# Altium schematic sheet LCD1807301228.SchDoc
size A3
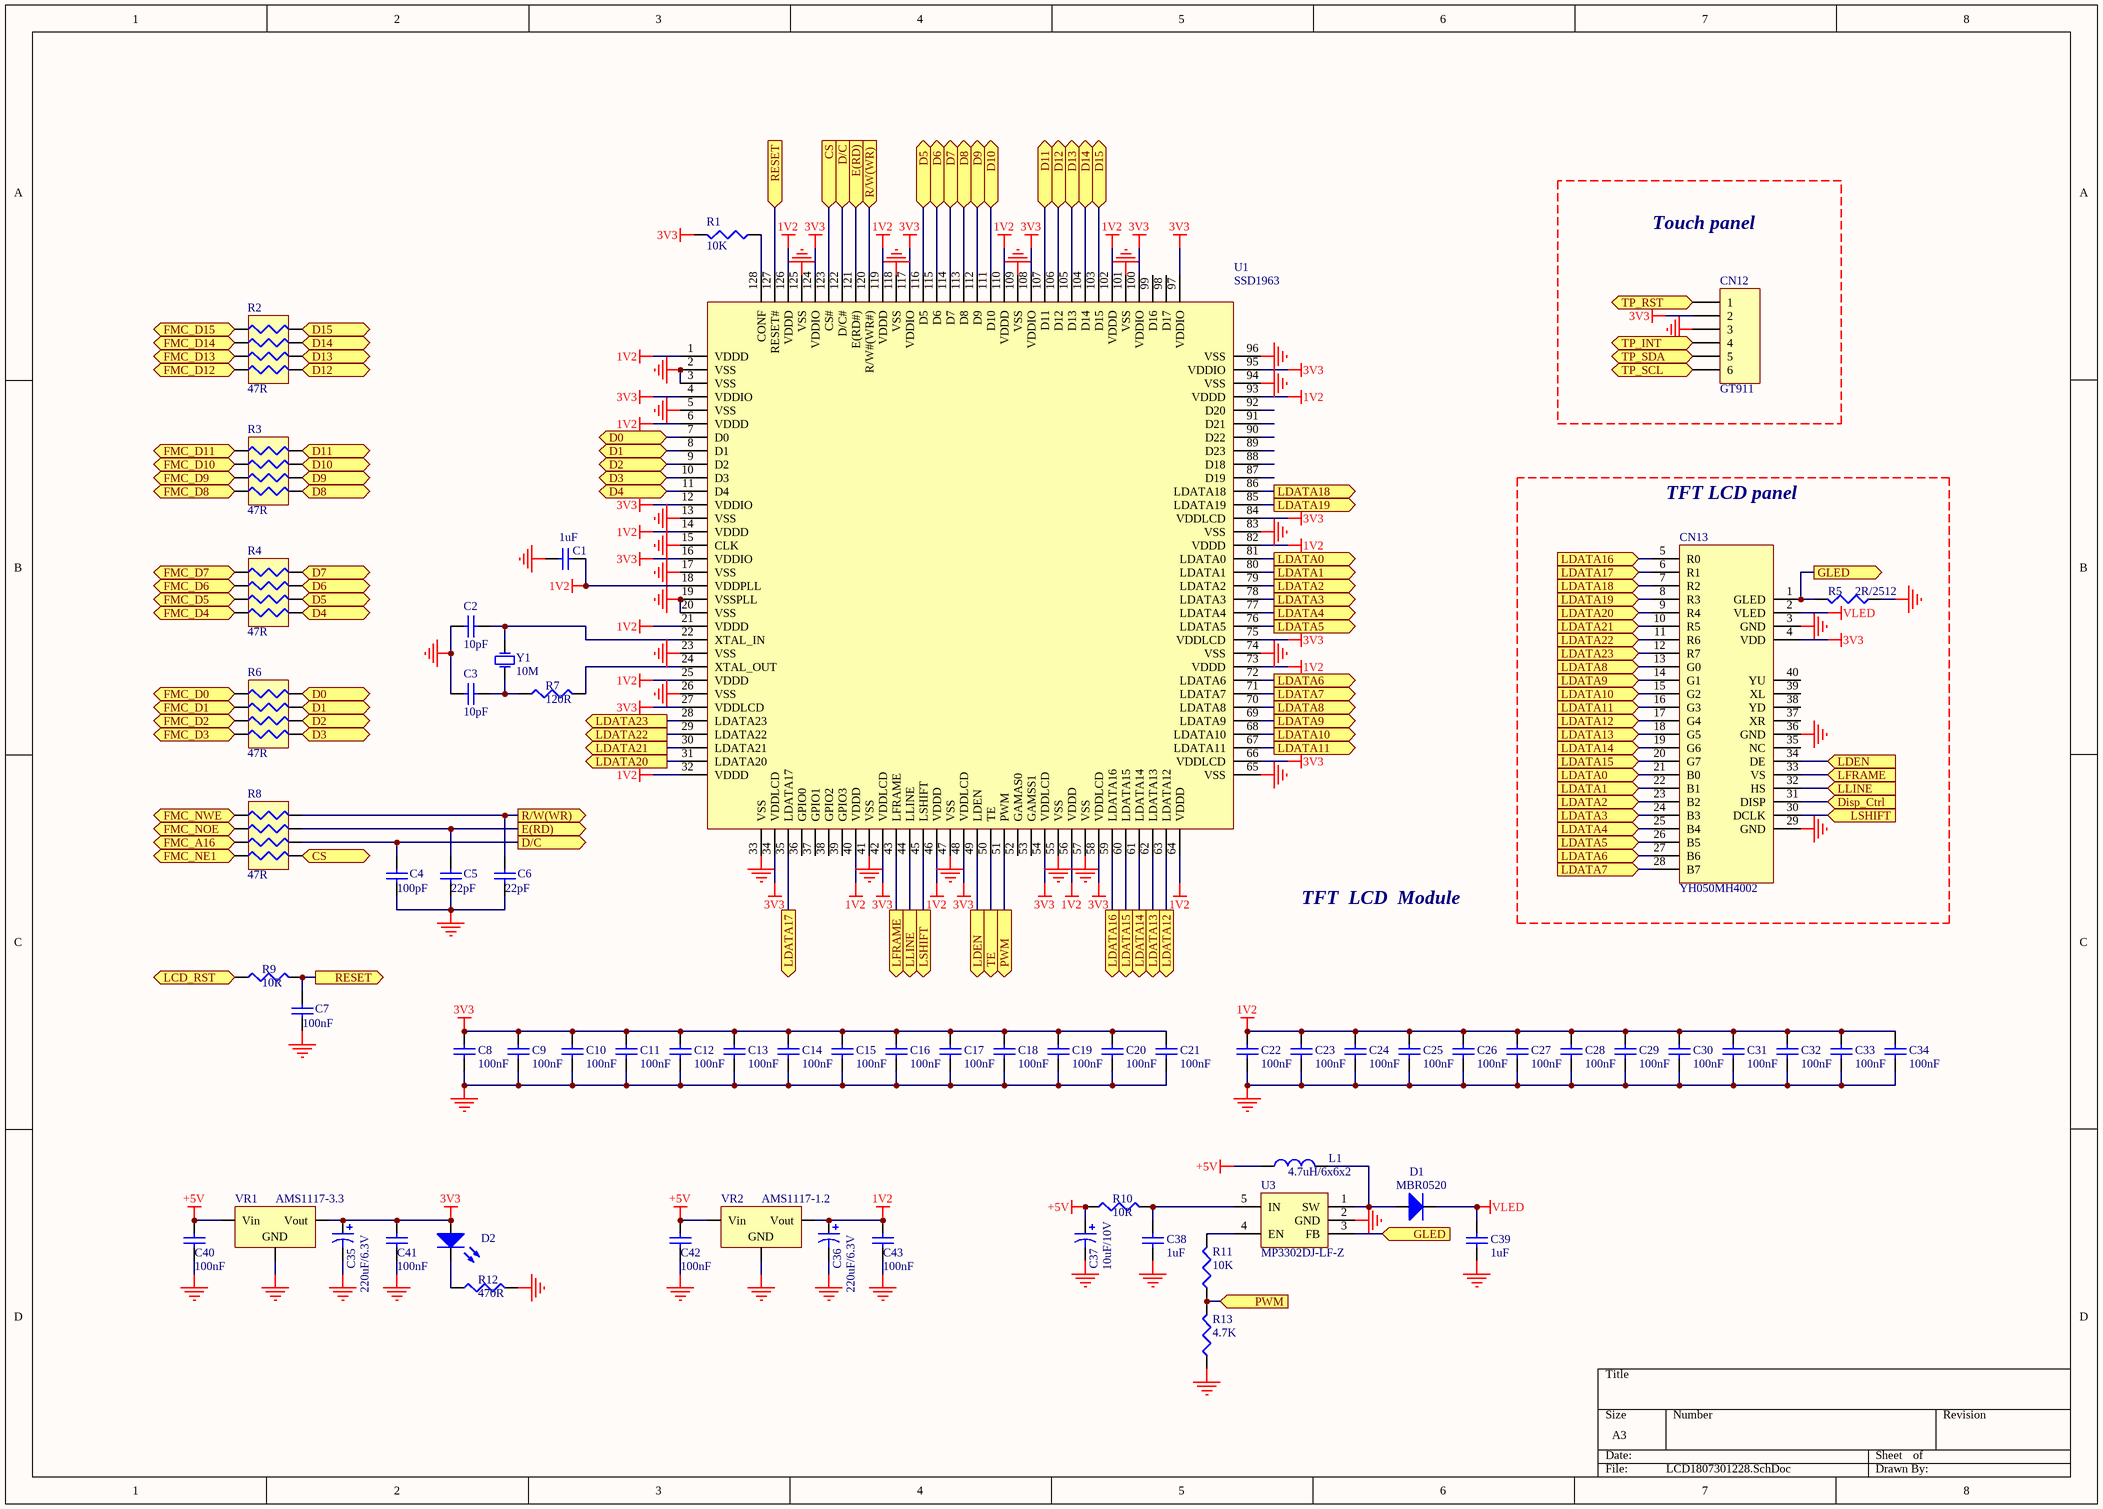
[diagram p0: LCD1807301228.SchDoc]

## Parts
C1  1uF  [C0603-3]
C2  10pF  [C0603-3]
C3  10pF  [C0603-3]
C4  100pF  [C0603-3]
C5  22pF  [C0603-3]
C6  22pF  [C0603-3]
C7  100nF  [C0603-3]
C8  100nF  [C0603-3]
C9  100nF  [C0603-3]
C10  100nF  [C0603-3]
C11  100nF  [C0603-3]
C12  100nF  [C0603-3]
C13  100nF  [C0603-3]
C14  100nF  [C0603-3]
C15  100nF  [C0603-3]
C16  100nF  [C0603-3]
C17  100nF  [C0603-3]
C18  100nF  [C0603-3]
C19  100nF  [C0603-3]
C20  100nF  [C0603-3]
C21  100nF  [C0603-3]
C22  100nF  [C0603-3]
C23  100nF  [C0603-3]
C24  100nF  [C0603-3]
C25  100nF  [C0603-3]
C26  100nF  [C0603-3]
C27  100nF  [C0603-3]
C28  100nF  [C0603-3]
C29  100nF  [C0603-3]
C30  100nF  [C0603-3]
C31  100nF  [C0603-3]
C32  100nF  [C0603-3]
C33  100nF  [C0603-3]
C34  100nF  [C0603-3]
C35  220uF/6.3V  [CASE-B_3528]
C36  220uF/6.3V  [CASE-B_3528]
C37  10uF/10V  [CASE-B_3528]
C38  1uF  [C0603-3]
C39  1uF  [C0603-3]
C40  100nF  [C0603-3]
C41  100nF  [C0603-3]
C42  100nF  [C0603-3]
C43  100nF  [C0603-3]
CN12  GT911  [FFC/SM0.5-2H6]
CN13  YH050MH4002  [FFC/SM0.5-2H40]
D1  MBR0520  [SOD-123]
D2  (no value)  [LED-0805]
L1  4.7uH/6x6x2  [L-SMD-6]
R1  10K  [R0603-3]
R2  47R  [R0603_x4]
R3  47R  [R0603_x4]
R4  47R  [R0603_x4]
R5  2R/2512  [2512]
R6  47R  [R0603_x4]
R7  120R  [R0603-3]
R8  47R  [R0603_x4]
R9  10R  [R0603-3]
R10  10R  [R0805-2]
R11  10K  [R0603-3]
R12  470R  [R0603-3]
R13  4.7K  [R0603-3]
U1  SSD1963  [LQFP128]
U3  MP3302DJ-LF-Z  [SOT-23-5]
VR1  AMS1117-3.3  [SOT-223]
VR2  AMS1117-1.2  [SOT-223]
Y1  10M  [OSC-5032_2P]

## Blocks framed on the sheet
Touch panel: CN12
TFT LCD panel: CN13 R5

## Ports
CS (in), CS (out), D0 (bidir), D1 (bidir), D2 (bidir), D3 (bidir), D4 (bidir), D5 (bidir), D6 (bidir), D7 (bidir), D8 (bidir), D9 (bidir), D10 (bidir), D11 (bidir), D12 (bidir), D13 (bidir), D14 (bidir), D15 (bidir), D/C (in), D/C (out), Disp_Ctrl (in), E(RD) (in), E(RD) (out), FMC_A16 (in), FMC_D0 (bidir), FMC_D1 (bidir), FMC_D2 (bidir), FMC_D3 (bidir), FMC_D4 (bidir), FMC_D5 (bidir), FMC_D6 (bidir), FMC_D7 (bidir), FMC_D8 (bidir), FMC_D9 (bidir), FMC_D10 (bidir), FMC_D11 (bidir), FMC_D12 (bidir), FMC_D13 (bidir), FMC_D14 (bidir), FMC_D15 (bidir), FMC_NE1 (in), FMC_NOE (in), FMC_NWE (in), GLED (in), GLED (out), LCD_RST (in), LDATA0 (in), LDATA0 (out), LDATA1 (in), LDATA1 (out), LDATA2 (in), LDATA2 (out), LDATA3 (in), LDATA3 (out), LDATA4 (in), LDATA4 (out), LDATA5 (in), LDATA5 (out), LDATA6 (in), LDATA6 (out), LDATA7 (in), LDATA7 (out), LDATA8 (in), LDATA8 (out), LDATA9 (in), LDATA9 (out), LDATA10 (in), LDATA10 (out), LDATA11 (in), LDATA11 (out), LDATA12 (in), LDATA12 (out), LDATA13 (in), LDATA13 (out), LDATA14 (in), LDATA14 (out), LDATA15 (in), LDATA15 (out), LDATA16 (in), LDATA16 (out), LDATA17 (in), LDATA17 (out), LDATA18 (in), LDATA18 (out), LDATA19 (in), LDATA19 (out), LDATA20 (in), LDATA20 (out), LDATA21 (in), LDATA21 (out), LDATA22 (in), LDATA22 (out), LDATA23 (in), LDATA23 (out), LDEN (in), LDEN (out), LFRAME (in), LFRAME (out), LLINE (in), LLINE (out), LSHIFT (in), LSHIFT (out), PWM (in), PWM (out), R/W(WR) (in), R/W(WR) (out), RESET (in), RESET (out), TE (out), TP_INT (out), TP_RST (in), TP_SCL (in), TP_SDA (bidir)

## Nets
1V2: C1.2 C22.2 C23.2 C24.2 C25.2 C26.2 C27.2 C28.2 C29.2 C30.2 C31.2 C32.2 C33.2 C34.2 C36.1 C43.2 U1.1(VDDD) U1.6(VDDD) U1.14(VDDD) U1.18(VDDPLL) U1.21(VDDD) U1.25(VDDD) U1.32(VDDD) U1.40(VDDD) U1.46(VDDD) U1.56(VDDD) U1.64(VDDD) U1.73(VDDD) U1.82(VDDD) U1.93(VDDD) U1.102(VDDD) U1.110(VDDD) U1.119(VDDD) U1.126(VDDD) VR2.2(Vout)
3V3: C8.2 C9.2 C10.2 C11.2 C12.2 C13.2 C14.2 C15.2 C16.2 C17.2 C18.2 C19.2 C20.2 C21.2 C35.1 C41.2 CN12.2 CN13.4(VDD) D2.1(A) R1.2 U1.4(VDDIO) U1.12(VDDIO) U1.16(VDDIO) U1.27(VDDLCD) U1.34(VDDLCD) U1.42(VDDLCD) U1.48(VDDLCD) U1.54(VDDLCD) U1.58(VDDLCD) U1.66(VDDLCD) U1.75(VDDLCD) U1.84(VDDLCD) U1.95(VDDIO) U1.97(VDDIO) U1.100(VDDIO) U1.108(VDDIO) U1.117(VDDIO) U1.124(VDDIO) VR1.2(Vout)
+5V: C37.1 C40.2 C42.2 L1.1 R10.1 VR1.3(Vin) VR2.3(Vin)
GND: C1.1 C2.2 C3.2 C4.1 C5.1 C6.1 C7.1 C8.1 C9.1 C10.1 C11.1 C12.1 C13.1 C14.1 C15.1 C16.1 C17.1 C18.1 C19.1 C20.1 C21.1 C22.1 C23.1 C24.1 C25.1 C26.1 C27.1 C28.1 C29.1 C30.1 C31.1 C32.1 C33.1 C34.1 C35.2 C36.2 C37.2 C38.1 C39.1 C40.1 C41.1 C42.1 C43.1 CN12.3 CN13.3(GND) CN13.29(GND) CN13.36(GND) R5.1 R12.2 R13.1 U1.2(VSS) U1.3(VSS) U1.5(VSS) U1.13(VSS) U1.15(CLK) U1.17(VSS) U1.19(VSSPLL) U1.20(VSS) U1.23(VSS) U1.26(VSS) U1.33(VSS) U1.41(VSS) U1.47(VSS) U1.55(VSS) U1.57(VSS) U1.65(VSS) U1.74(VSS) U1.83(VSS) U1.94(VSS) U1.96(VSS) U1.101(VSS) U1.109(VSS) U1.118(VSS) U1.125(VSS) U3.2(GND) VR1.1(GND) VR2.1(GND)
VLED: C39.2 CN13.2(VLED) D1.2(K)
CS: R8.8 U1.123(CS#) ; port CS
D0: R6.2 U1.7(D0) ; port D0
D1: R6.4 U1.8(D1) ; port D1
D2: R6.6 U1.9(D2) ; port D2
D3: R6.8 U1.10(D3) ; port D3
D4: R4.8 U1.11(D4) ; port D4
D5: R4.6 U1.116(D5) ; port D5
D6: R4.4 U1.115(D6) ; port D6
D7: R4.2 U1.114(D7) ; port D7
D8: R3.8 U1.113(D8) ; port D8
D9: R3.6 U1.112(D9) ; port D9
D10: R3.4 U1.111(D10) ; port D10
D11: R3.2 U1.107(D11) ; port D11
D12: R2.8 U1.106(D12) ; port D12
D13: R2.6 U1.105(D13) ; port D13
D14: R2.4 U1.104(D14) ; port D14
D15: R2.2 U1.103(D15) ; port D15
D/C: C4.2 R8.6 U1.122(D/C#) ; port D/C
Disp_Ctrl: CN13.31(DISP) ; port Disp_Ctrl
E(RD): C5.2 R8.4 U1.121(E(RD#)) ; port E(RD)
FMC_A16: R8.5 ; port FMC_A16
FMC_D0: R6.1 ; port FMC_D0
FMC_D1: R6.3 ; port FMC_D1
FMC_D2: R6.5 ; port FMC_D2
FMC_D3: R6.7 ; port FMC_D3
FMC_D4: R4.7 ; port FMC_D4
FMC_D5: R4.5 ; port FMC_D5
FMC_D6: R4.3 ; port FMC_D6
FMC_D7: R4.1 ; port FMC_D7
FMC_D8: R3.7 ; port FMC_D8
FMC_D9: R3.5 ; port FMC_D9
FMC_D10: R3.3 ; port FMC_D10
FMC_D11: R3.1 ; port FMC_D11
FMC_D12: R2.7 ; port FMC_D12
FMC_D13: R2.5 ; port FMC_D13
FMC_D14: R2.3 ; port FMC_D14
FMC_D15: R2.1 ; port FMC_D15
FMC_NE1: R8.7 ; port FMC_NE1
FMC_NOE: R8.3 ; port FMC_NOE
FMC_NWE: R8.1 ; port FMC_NWE
GLED: CN13.1(GLED) R5.2 U3.3(FB) ; port GLED
LCD_RST: R9.1 ; port LCD_RST
LDATA0: CN13.21(B0) U1.81(LDATA0) ; port LDATA0
LDATA1: CN13.22(B1) U1.80(LDATA1) ; port LDATA1
LDATA2: CN13.23(B2) U1.79(LDATA2) ; port LDATA2
LDATA3: CN13.24(B3) U1.78(LDATA3) ; port LDATA3
LDATA4: CN13.25(B4) U1.77(LDATA4) ; port LDATA4
LDATA5: CN13.26(B5) U1.76(LDATA5) ; port LDATA5
LDATA6: CN13.27(B6) U1.72(LDATA6) ; port LDATA6
LDATA7: CN13.28(B7) U1.71(LDATA7) ; port LDATA7
LDATA8: CN13.13(G0) U1.70(LDATA8) ; port LDATA8
LDATA9: CN13.14(G1) U1.69(LDATA9) ; port LDATA9
LDATA10: CN13.15(G2) U1.68(LDATA10) ; port LDATA10
LDATA11: CN13.16(G3) U1.67(LDATA11) ; port LDATA11
LDATA12: CN13.17(G4) U1.63(LDATA12) ; port LDATA12
LDATA13: CN13.18(G5) U1.62(LDATA13) ; port LDATA13
LDATA14: CN13.19(G6) U1.61(LDATA14) ; port LDATA14
LDATA15: CN13.20(G7) U1.60(LDATA15) ; port LDATA15
LDATA16: CN13.5(R0) U1.59(LDATA16) ; port LDATA16
LDATA17: CN13.6(R1) U1.35(LDATA17) ; port LDATA17
LDATA18: CN13.7(R2) U1.86(LDATA18) ; port LDATA18
LDATA19: CN13.8(R3) U1.85(LDATA19) ; port LDATA19
LDATA20: CN13.9(R4) U1.31(LDATA20) ; port LDATA20
LDATA21: CN13.10(R5) U1.30(LDATA21) ; port LDATA21
LDATA22: CN13.11(R6) U1.29(LDATA22) ; port LDATA22
LDATA23: CN13.12(R7) U1.28(LDATA23) ; port LDATA23
LDEN: CN13.34(DE) U1.49(LDEN) ; port LDEN
LFRAME: CN13.33(VS) U1.43(LFRAME) ; port LFRAME
LLINE: CN13.32(HS) U1.44(LLINE) ; port LLINE
LSHIFT: CN13.30(DCLK) U1.45(LSHIFT) ; port LSHIFT
PWM: R11.1 R13.2 U1.51(PWM) ; port PWM
R/W(WR): C6.2 R8.2 U1.120(R/W#(WR#)) ; port R/W(WR)
RESET: C7.2 R9.2 U1.127(RESET#) ; port RESET
TE: U1.50(TE) ; port TE
TP_INT: CN12.4 ; port TP_INT
TP_RST: CN12.1 ; port TP_RST
TP_SCL: CN12.6 ; port TP_SCL
TP_SDA: CN12.5 ; port TP_SDA
NetC2_1: C2.1 U1.22(XTAL_IN) Y1.2(OSC2)
NetC3_1: C3.1 R7.1 Y1.1(OSC1)
NetC38_2: C38.2 R10.2 U3.5(IN)
NetD1_1: D1.1(A) L1.2 U3.1(SW)
NetD2_2: D2.2(K) R12.1
NetR1_1: R1.1 U1.128(CONF)
NetR7_2: R7.2 U1.24(XTAL_OUT)
NetR11_2: R11.2 U3.4(EN)

Not connected (* = marked no-connect by the designer): CN13 35(NC) 37(XR) 38(YD) 39(XL) 40(YU); U1 36(GPIO0) 37(GPIO1) 38(GPIO2) 39(GPIO3) 52(GAMAS0) 53(GAMSS1) 87(D19) 88(D18) 89(D23) 90(D22) 91(D21) 92(D20) 98(D17) 99(D16)

## Notes on the sheet
- TFT  LCD  Module

## Library data of the parts
C1-C3 C5-C34 C38-C43 = Cap: Capacitor; Value: 100pF; Published: 8-Jun-2000; LatestRevisionDate: 17-Jul-2002; LatestRevisionNote: Re-released for DXP Platform.; PackageReference: RAD-0.3; Publisher: Altium Limited; PackageDescription: Radial Cap, Thru-Hole; 2 Leads; 0.3 in Pin Spacing
C4 = Cap: Capacitor; Published: 8-Jun-2000; LatestRevisionDate: 17-Jul-2002; LatestRevisionNote: Re-released for DXP Platform.; PackageReference: RAD-0.3; Publisher: Altium Limited; PackageDescription: Radial Cap, Thru-Hole; 2 Leads; 0.3 in Pin Spacing; Value: 100pF
C35-C37 = Cap Pol1: Polarized Capacitor (Radial); Value: 100pF; Published: 8-Jun-2000; LatestRevisionDate: 17-Jul-2002; LatestRevisionNote: Re-released for DXP Platform.; PackageReference: RB7.6-15; Publisher: Altium Limited; PackageDescription: Polarized Capacitor (Radial); 2 Leads
CN12 = Header 6: Header, 6-Pin; LatestRevisionDate: 17-Jul-2002; LatestRevisionNote: Re-released for DXP Platform.; Publisher: Altium Limited
CN13 = YH050MH4002: 5.0 inch(Diagonal) TFT-LCD panels, 800× 3(RGB) × 480, RGB interface
D1 = Diode: Default Diode; Published: 8-Jun-2000; LatestRevisionDate: 17-Jul-2002; LatestRevisionNote: Re-released for DXP Platform.; PackageVersion: Sep-1996; PackageReference: SMC; Publisher: Altium Limited; PackageDescription: DO-214-AB/SMC; 2 C-Bend Leads; Body 7.9 x 5.9 mm, inc. leads (LxW); Code_JEDEC: DO-214-AB
D2 = LED0: Typical INFRARED GaAs LED; Published: 8-Jun-2000; LatestRevisionDate: 08-Jul-2005; LatestRevisionNote: Mech Layer 1 removed.; PackageReference: LED-0; Publisher: Altium Limited; PackageDescription: LED; 2 Leads
L1 = Inductor: Code_IEC: 1005; Published: 8-Jun-2000; LatestRevisionDate: 29-May-2009; LatestRevisionNote: IPC-7351 Footprint Added.; PackageReference: 0402-A; Publisher: Altium Limited; PackageDescription: Chip Inductor; Code_JEITA: 0402
R1 R5 R7 R9-R13 = Res3: Resistor; Value: 1K; Published: 8-Jun-2000; LatestRevisionDate: 29-May-2009; LatestRevisionNote: IPC-7351 Footprint Added.; PackageReference: J1-0603; Publisher: Altium Limited; PackageDescription: Chip Resistor
R2-R4 R6 R8 = Res 4 array: Chip Resistor 4 Array
U1 = SSD1963: 1215KB Embedded Display SRAM  LCD Display Controller
U3 = MP3302: 40V, 1.3A, Single-cell Step-up  White LED Driver  with Single Wire Dimming Control
VR1 VR2 = Volt Reg 2: Voltage Regulator; Published: 24-Mar-1999; LatestRevisionDate: 29-May-2009; LatestRevisionNote: IPC-7351 Footprint Added.; PackageReference: D2PAK; Publisher: Altium Limited; PackageDescription: 3-Pin Transistor Outline Package 2.54 mm Pitch, 15.1 mm Lead Span
Y1 = XTAL: Crystal Oscillator; Published: 8-Jun-2000; LatestRevisionDate: 17-Jul-2002; LatestRevisionNote: Re-released for DXP Platform.; PackageReference: R38; Publisher: Altium Limited; PackageDescription: Crystal, Thru-Hole; 2 Leads; Body 3.1 x 8.2 mm (Dia.xH)